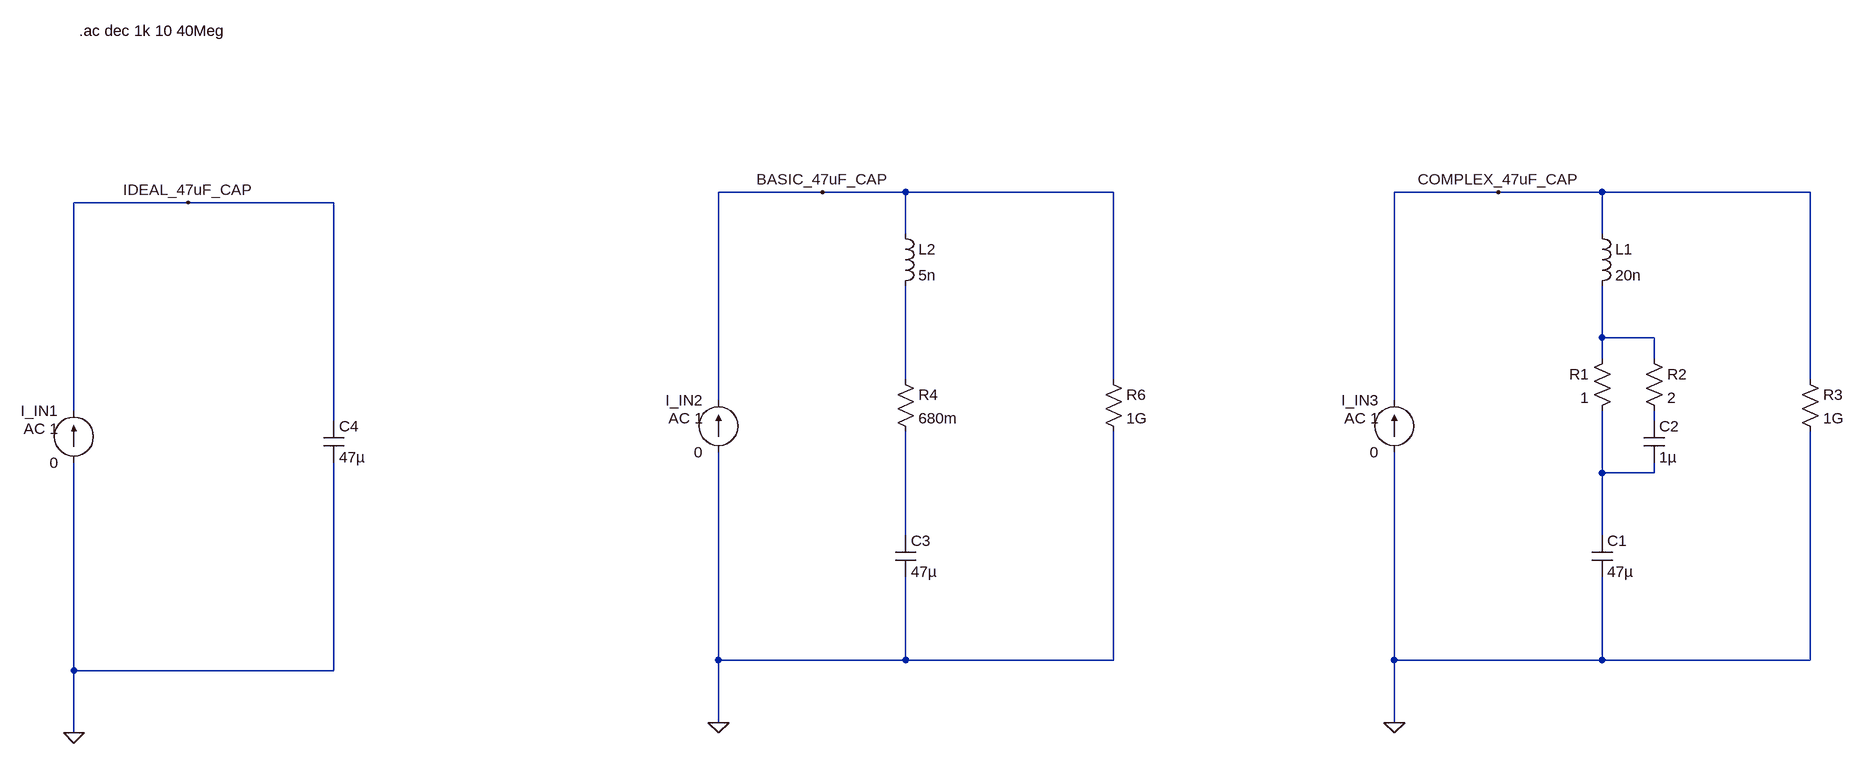
[diagram p0: schematic Example_Electrolytic_47uF_Cap.asc]
Example_Electrolytic_47uF_Cap.asc, the LTspice schematic file:
Version 4.1
SHEET 1 1560 680
WIRE -800 -368 -960 -368
WIRE -672 -368 -800 -368
WIRE -352 -368 -672 -368
WIRE 240 -368 80 -368
WIRE 400 -368 240 -368
WIRE 720 -368 400 -368
WIRE -1776 -352 -1952 -352
WIRE -1552 -352 -1776 -352
WIRE -672 -304 -672 -368
WIRE 400 -304 400 -368
WIRE 400 -144 400 -224
WIRE 480 -144 400 -144
WIRE 400 -112 400 -144
WIRE 480 -112 480 -144
WIRE -672 -80 -672 -224
WIRE -352 -80 -352 -368
WIRE 720 -80 720 -368
WIRE -960 -48 -960 -368
WIRE 80 -48 80 -368
WIRE -1952 -32 -1952 -352
WIRE -1552 -16 -1552 -352
WIRE 480 -16 480 -32
WIRE 400 64 400 -32
WIRE 480 64 480 48
WIRE 480 64 400 64
WIRE -672 160 -672 0
WIRE 400 160 400 64
WIRE -960 352 -960 32
WIRE -672 352 -672 224
WIRE -672 352 -960 352
WIRE -352 352 -352 0
WIRE -352 352 -672 352
WIRE 80 352 80 32
WIRE 400 352 400 224
WIRE 400 352 80 352
WIRE 720 352 720 0
WIRE 720 352 400 352
WIRE -1952 368 -1952 48
WIRE -1552 368 -1552 48
WIRE -1552 368 -1952 368
WIRE -960 448 -960 352
WIRE 80 448 80 352
WIRE -1952 464 -1952 368
FLAG 80 448 0
FLAG -960 448 0
FLAG -1952 464 0
FLAG -1776 -352 IDEAL_47uF_CAP
FLAG -800 -368 BASIC_47uF_CAP
FLAG 240 -368 COMPLEX_47uF_CAP
SYMBOL cap 384 160 R0
SYMATTR InstName C1
SYMATTR Value 47µ
SYMBOL res 416 -128 M0
SYMATTR InstName R1
SYMATTR Value 1
SYMBOL res 464 -128 R0
SYMATTR InstName R2
SYMATTR Value 2
SYMBOL ind 384 -320 R0
SYMATTR InstName L1
SYMATTR Value 20n
SYMBOL res 704 -96 R0
SYMATTR InstName R3
SYMATTR Value 1G
SYMBOL current 80 32 R180
WINDOW 0 24 80 Left 2
WINDOW 3 24 0 Left 2
WINDOW 123 24 52 Left 2
WINDOW 39 0 0 Left 0
SYMATTR InstName I_IN3
SYMATTR Value 0
SYMATTR Value2 AC 1
SYMBOL cap 464 -16 R0
SYMATTR InstName C2
SYMATTR Value 1µ
SYMBOL cap -688 160 R0
SYMATTR InstName C3
SYMATTR Value 47µ
SYMBOL ind -688 -320 R0
SYMATTR InstName L2
SYMATTR Value 5n
SYMBOL res -368 -96 R0
SYMATTR InstName R6
SYMATTR Value 1G
SYMBOL current -960 32 R180
WINDOW 0 24 80 Left 2
WINDOW 3 24 0 Left 2
WINDOW 123 24 52 Left 2
WINDOW 39 0 0 Left 0
SYMATTR InstName I_IN2
SYMATTR Value 0
SYMATTR Value2 AC 1
SYMBOL res -688 -96 R0
SYMATTR InstName R4
SYMATTR Value 680m
SYMBOL cap -1568 -16 R0
SYMATTR InstName C4
SYMATTR Value 47µ
SYMBOL current -1952 48 R180
WINDOW 0 24 80 Left 2
WINDOW 3 24 0 Left 2
WINDOW 123 24 52 Left 2
WINDOW 39 0 0 Left 0
SYMATTR InstName I_IN1
SYMATTR Value 0
SYMATTR Value2 AC 1
TEXT -1944 -616 Left 2 !.ac dec 1k 10 40Meg

The netlist it stands for:
* Example_Electrolytic_47uF_Cap.asc
C1 N004 0 47µ
R1 N001 N004 1
R2 N001 N003 2
L1 COMPLEX_47uF_CAP N001 20n
R3 COMPLEX_47uF_CAP 0 1G
I_IN3 0 COMPLEX_47uF_CAP 0 AC 1
C2 N003 N004 1µ
C3 N005 0 47µ
L2 BASIC_47uF_CAP N002 5n
R6 BASIC_47uF_CAP 0 1G
I_IN2 0 BASIC_47uF_CAP 0 AC 1
R4 N002 N005 680m
C4 IDEAL_47uF_CAP 0 47µ
I_IN1 0 IDEAL_47uF_CAP 0 AC 1
.ac dec 1k 10 40Meg
.backanno
.end